# EAGLE schematic 00A-006 (EAGLE 6.3)
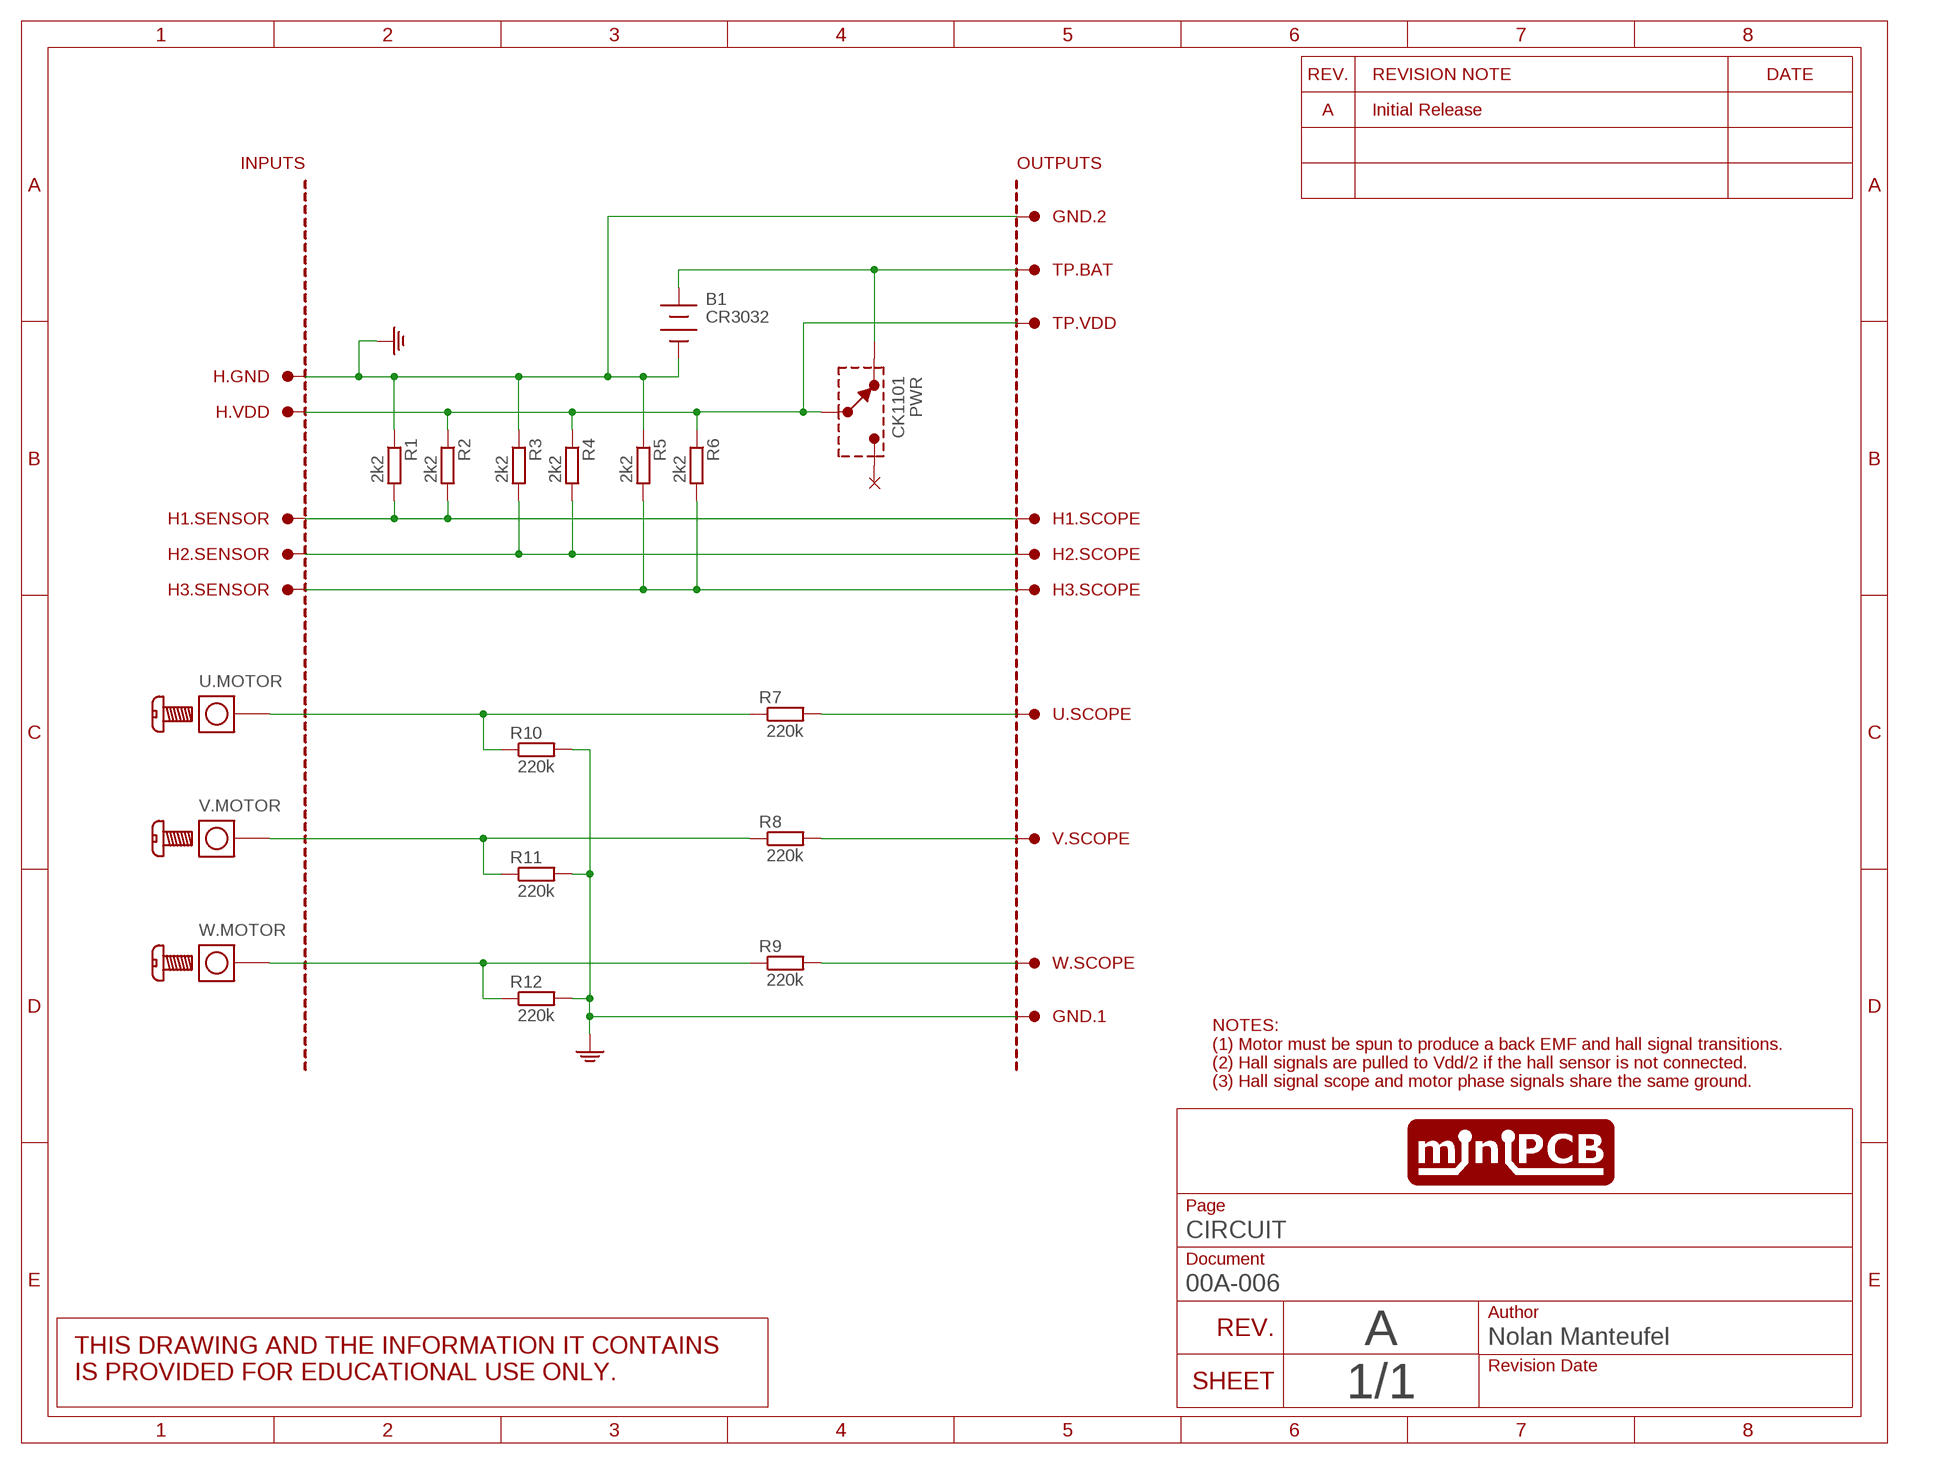
[diagram p0: schematic, sheet 1]
SHEET1 (SCHEMATIC): REVISION: A

## Parts
B1  CR3032  BATTERYKE3034  [BATTERY-CR3032-KE3034]
GND.1  TESTPOINTKE5000  [PINS_1_TESTPOINT_KE5000]
GND.2  TESTPOINTKE5000  [PINS_1_TESTPOINT_KE5000]
H1.SCOPE  TESTPOINTKE5000  [PINS_1_TESTPOINT_KE5000]
H1.SENSOR  H1  TESTPOINT24AWG  [PINS_1_1MM]
H2.SCOPE  TESTPOINTKE5000  [PINS_1_TESTPOINT_KE5000]
H2.SENSOR  H2  TESTPOINT24AWG  [PINS_1_1MM]
H3.SCOPE  TESTPOINTKE5000  [PINS_1_TESTPOINT_KE5000]
H3.SENSOR  H3  TESTPOINT24AWG  [PINS_1_1MM]
H.GND  GND  TESTPOINT24AWG  [PINS_1_1MM]
H.VDD  VDD  TESTPOINT24AWG  [PINS_1_1MM]
PWR  CK1101  SPDTM2S3CQE2  [CK1101]
R1  2k2  RESISTORSMD  [R0805]
R2  2k2  RESISTORSMD  [R0805]
R3  2k2  RESISTORSMD  [R0805]
R4  2k2  RESISTORSMD  [R0805]
R5  2k2  RESISTORSMD  [R0805]
R6  2k2  RESISTORSMD  [R0805]
R7  220k  RESISTORSMD  [R0805]
R8  220k  RESISTORSMD  [R0805]
R9  220k  RESISTORSMD  [R0805]
R10  220k  RESISTORSMD  [R0805]
R11  220k  RESISTORSMD  [R0805]
R12  220k  RESISTORSMD  [R0805]
TP.BAT  TESTPOINTKE5000-SMTEXT  [PINS_1_TESTPOINT_KE5000_NOTEXT]
TP.VDD  TESTPOINTKE5000-SMTEXT  [PINS_1_TESTPOINT_KE5000_NOTEXT]
U$1  MINIPCB_0P50X100  [MINIPCB_0P_50X100]
U.MOTOR  SCREW-TERMINAL  [SCREW-TERMINAL-M3]
U.SCOPE  TESTPOINTKE5000  [PINS_1_TESTPOINT_KE5000]
V.MOTOR  SCREW-TERMINAL  [SCREW-TERMINAL-M3]
V.SCOPE  TESTPOINTKE5000  [PINS_1_TESTPOINT_KE5000]
W.MOTOR  SCREW-TERMINAL  [SCREW-TERMINAL-M3]
W.SCOPE  TESTPOINTKE5000  [PINS_1_TESTPOINT_KE5000]

## Nets
GND: B1.3-(-) GND.1.1 GND.2.1 H.GND.1 H.GND.2 R1.1 R3.1 R5.1 R10.2 R11.2 R12.2
H1: H1.SCOPE.1 H1.SENSOR.1 H1.SENSOR.2 R1.2 R2.2
H2: H2.SCOPE.1 H2.SENSOR.1 H2.SENSOR.2 R3.2 R4.2
H3: H3.SCOPE.1 H3.SENSOR.1 H3.SENSOR.2 R5.2 R6.2
HVDD: H.VDD.1 H.VDD.2 PWR.P$2 R2.1 R4.1 R6.1 TP.VDD.1
U.MOTOR: R7.1 R10.1 U.MOTOR.1 U.MOTOR.2 U.MOTOR.3 U.MOTOR.4
U.SCOPE: R7.2 U.SCOPE.1
V.BAT: B1.1+(+) B1.2+(+) PWR.P$1 TP.BAT.1
V.MOTOR: R8.1 R11.1 V.MOTOR.1 V.MOTOR.2 V.MOTOR.3 V.MOTOR.4
V.SCOPE: R8.2 V.SCOPE.1
W.MOTOR: R9.1 R12.1 W.MOTOR.1 W.MOTOR.2 W.MOTOR.3 W.MOTOR.4
W.SCOPE: R9.2 W.SCOPE.1
Unconnected: PWR.P$3

## Notes on the sheet
- NOTES:
  (1) Motor must be spun to produce a back EMF and hall signal transitions.
  (2) Hall signals are pulled to Vdd/2 if the hall sensor is not connected.
  (3) Hall signal scope and motor phase signals share the same ground.

## Library data of the parts
B1 = minipcb:BATTERY: 2xAAA battery holder for VIVA
GND.1 GND.2 H1.SCOPE H1.SENSOR H2.SCOPE H2.SENSOR H3.SCOPE H3.SENSOR H.GND H.VDD TP.BAT TP.VDD U.SCOPE V.SCOPE W.SCOPE = minipcb:TESTPOINT
PWR = minipcb:SPDT
R1-R12 = minipcb:RESISTOR
U$1 = minipcb:MINIPCB_0P; PART_NUMBER: #00A-006; REVISION: A
U.MOTOR V.MOTOR W.MOTOR = minipcb:SCREW-TERMINAL